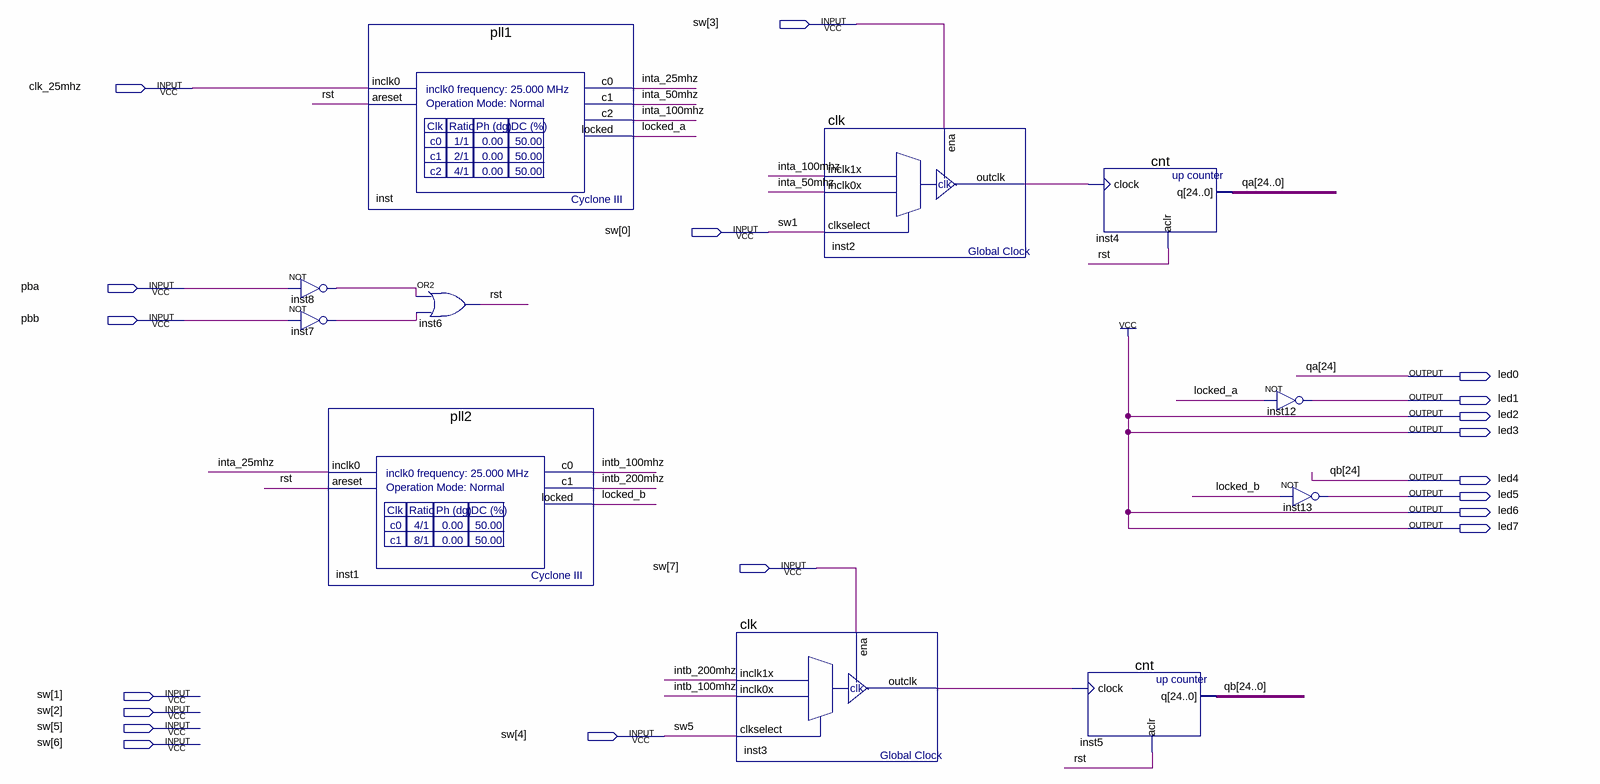
[diagram p0: schematic sheet]
// Quartus schematic gener.bdf as structural Verilog: 11 symbols, 19 pins
module gener (
  input  [7:0] sw,
  input  clk_25mhz,
  input  pba,
  input  pbb,
  output led0,
  output led1,
  output led2,
  output led3,
  output led4,
  output led5,
  output led6,
  output led7
);

  wire inst2_outclk, inst3_outclk, inst7_out, inst8_out, inta_25mhz, inta_50mhz, inta_100mhz, intb_100mhz,
       intb_200mhz, locked_a, locked_b, rst;
  wire [23:0] qa, qb;

  not inst8 (inst8_out, pba);
  not inst7 (inst7_out, pbb);
  pll2 inst1 (.inclk0(inta_25mhz), .areset(rst), .c0(intb_100mhz), .c1(intb_200mhz), .locked(locked_b));
  pll1 inst (.inclk0(clk_25mhz), .areset(rst), .c0(inta_25mhz), .c1(inta_50mhz), .c2(inta_100mhz), .locked(locked_a));
  or inst6 (rst, inst8_out, inst7_out);
  clk inst3 (.clkselect(sw[5]), .ena(sw[7]), .inclk1x(intb_200mhz), .inclk0x(intb_100mhz), .outclk(inst3_outclk));
  clk inst2 (.clkselect(sw[1]), .ena(sw[3]), .inclk1x(inta_100mhz), .inclk0x(inta_50mhz), .outclk(inst2_outclk));
  cnt inst4 (.clock(inst2_outclk), .aclr(rst), .q({led0, qa}));
  cnt inst5 (.clock(inst3_outclk), .aclr(rst), .q({led4, qb}));
  not inst12 (led1, locked_a);
  not inst13 (led5, locked_b);

  assign led2 = 1'b1;
  assign led3 = 1'b1;
  assign led6 = 1'b1;
  assign led7 = 1'b1;
  assign {sw[4], sw[0]} = {sw[5], sw[1]};

  // Other names for the same wires on the sheet: qa[24] = led0; qb[24] = led4
endmodule
